# EAGLE design Simonette (EAGLE 5.11)
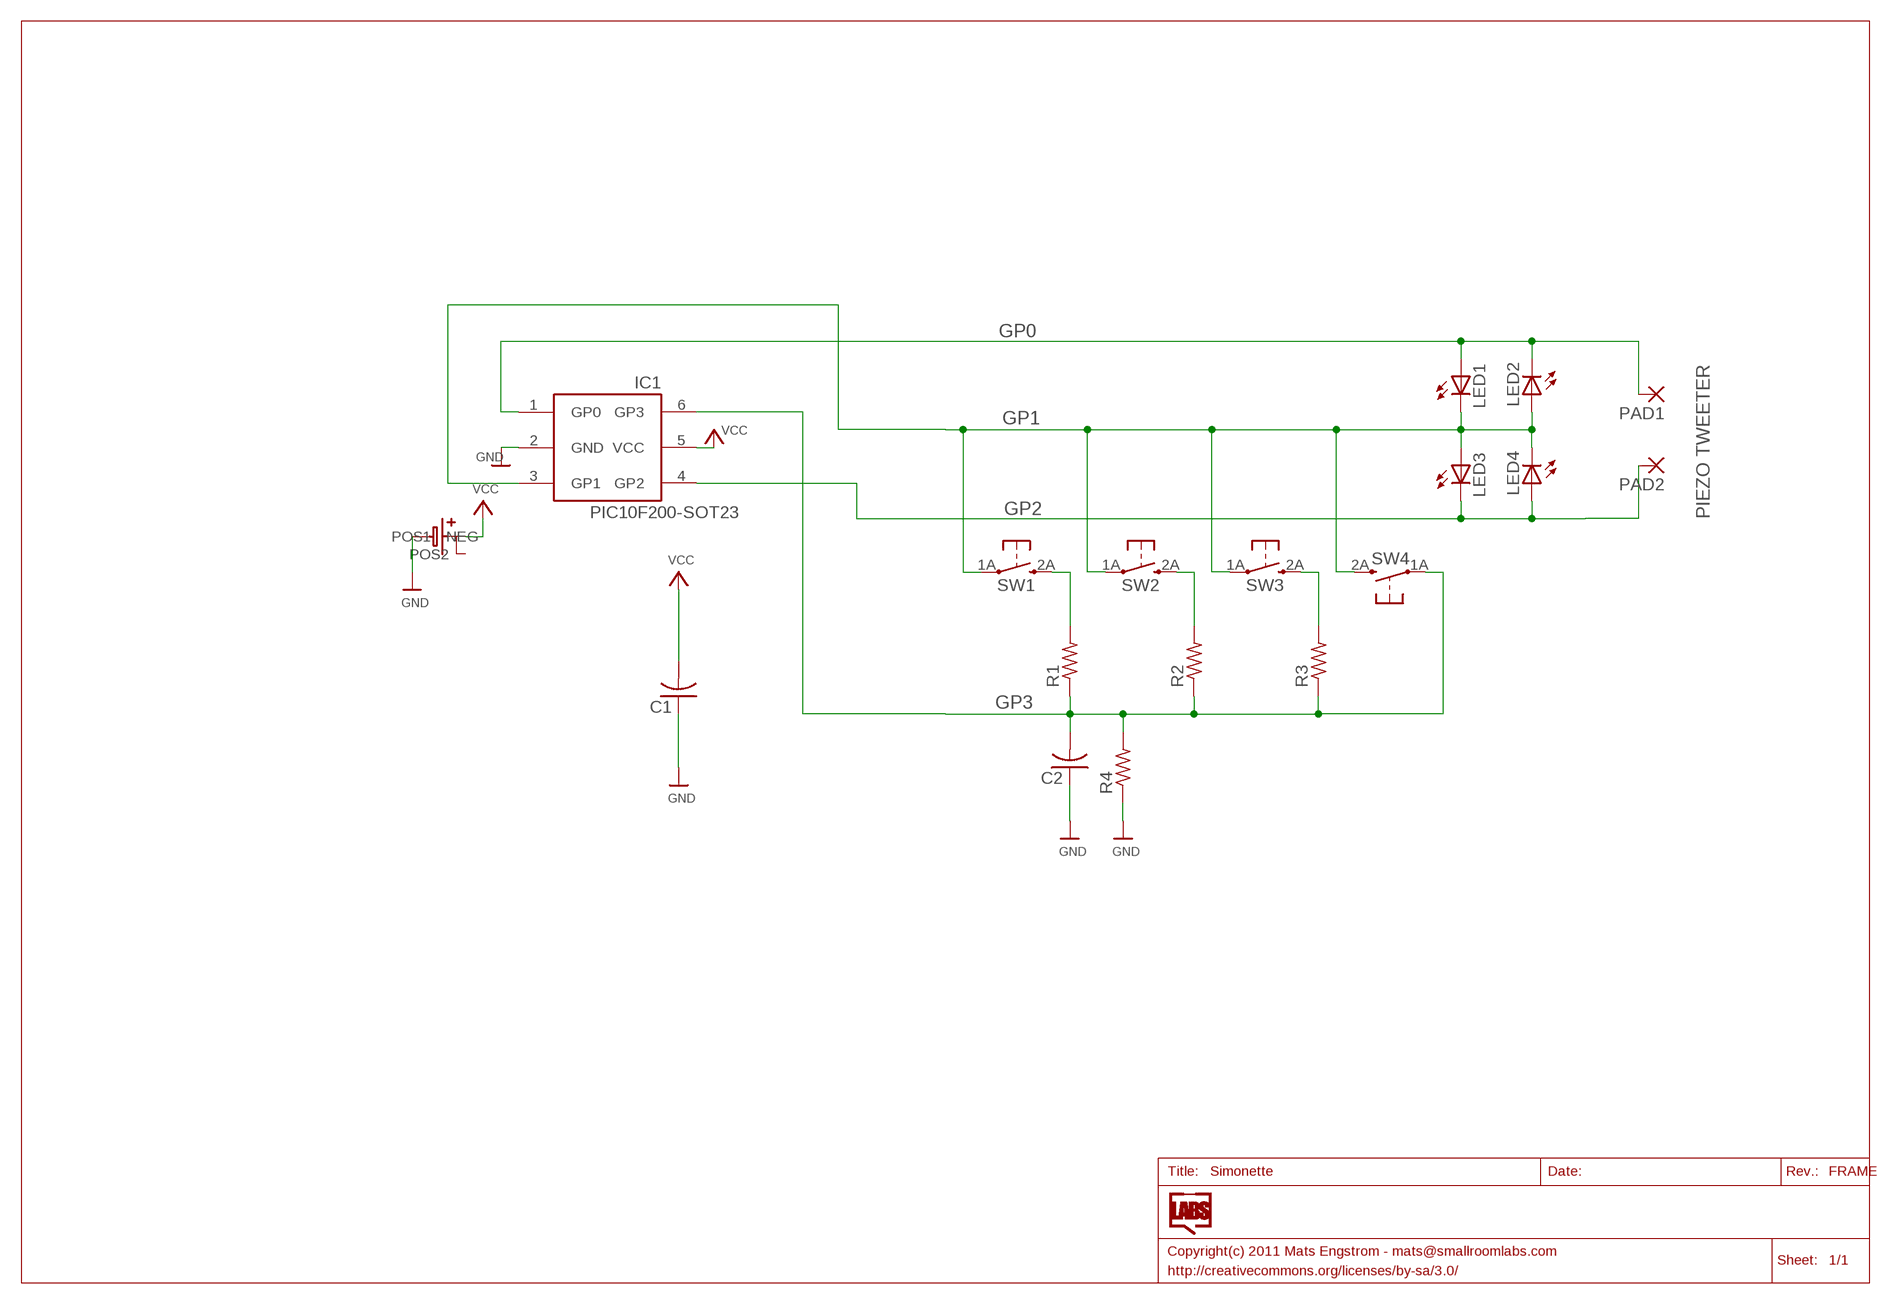
[diagram p0: schematic, sheet 1]

## Parts
C1  C-USC0805  [C0805]
C2  C-USC0805  [C0805]
IC1  PIC10F200-SOT23  [SOT23-6]
LED1  LEDCHIP-LED0805  [CHIP-LED0805]
LED2  LEDCHIP-LED0805  [CHIP-LED0805]
LED3  LEDCHIP-LED0805  [CHIP-LED0805]
LED4  LEDCHIP-LED0805  [CHIP-LED0805]
PAD1  SMD2  [SMD1,27-2,54]
PAD2  SMD2  [SMD1,27-2,54]
R1  R-US_R0805W  [R0805W]
R2  R-US_R0805W  [R0805W]
R3  R-US_R0805W  [R0805W]
R4  R-US_R0805W  [R0805W]
SW1  TACTILE1  [TACTILE-PTH-4.5-HALF]
SW2  TACTILE1  [TACTILE-PTH-4.5-HALF]
SW3  TACTILE1  [TACTILE-PTH-4.5-HALF]
SW4  TACTILE1  [TACTILE-PTH-4.5-HALF]
U$6  BATTERYCOIN-12MM-SMD  [CR1220-SMD]

## Nets
GND: C1.1 C2.1 IC1.2(GND) R4.1 U$6.-(NEG)
GP0: IC1.1(GP0) LED1.A LED2.C PAD1.1(P)
GP1: IC1.3(GP1) LED1.C LED2.A LED3.A LED4.C SW1.1A SW2.1A SW3.1A SW4.2A
GP2: IC1.4(GP2) LED3.C LED4.A PAD2.1(P)
GP3: C2.2 IC1.6(GP3) R1.1 R2.1 R3.1 R4.2 SW4.1A
N$1: R1.2 SW1.2A
N$3: R2.2 SW2.2A
N$4: R3.2 SW3.2A
VCC: C1.2 IC1.5(VCC) U$6.+$1(POS1)

## Notes on the sheet
- PIEZO TWEETER

## Power pins joined to a net without a drawn wire
POS2: U$6.+$2(POS2)

## Library data of the parts
C1 C2 = adafruit:C-US: CAPACITOR, American symbol
IC1 = SmallRoomLabs:PIC10F200
LED1-LED4 = adafruit:LED: LED OSRAM: - CHIPLED LG R971, LG N971, LY N971, LG Q971, LY Q971, LO R971, LY R971 LH N974, LH R974 LS Q976, LO Q976, LY Q976 LO Q996 - Hyper CHIPLED LW Q18S LB Q993, LB Q99A, LB R99A - SideLED LS A670, LO A670, LY A670, LG A670, LP A670 LB A673, LV A673, LT A673, LW A673 LH A674 LY A675 LS A676, LA A676, LO A676, LY A676, LW A676 LS A679, LY A679, LG A679 - Hyper Micro SIDELED® LS Y876, LA Y876, LO Y876, LY Y876 LT Y87S - SmartLED LW L88C, LW L88S LB L89C, LB L89S, LG L890 LS L89K, LO L89K, LY L89K LS L896, LA L896, LO L896, LY L896 - TOPLED LS T670, LO T670, LY T670, LG T670, LP T670 LSG T670, LSP T670, LSY T670, LOP T670, LYG T670 LG T671, LOG T671, LSG T671 LB T673, LV T673, LT T673, LW T673 LH T674 LS T676, LA T676, LO T676, LY T676, LB T676, LH T676, LSB T676, LW T676 LB T67C, LV T67C, LT T67C, LS T67K, LO T67K, LY T67K, LW E67C LS E67B, LA E67B, LO E67B, LY E67B, LB E67C, LV E67C, LT E67C LW T67C LS T679, LY T679, LG T679 LS T770, LO T770, LY T770, LG T770, LP T770 LB T773, LV T773, LT T773, LW T773 LH T774 LS E675, LA E675, LY E675, LS T675 LS T776, LA T776, LO T776, LY T776, LB T776 LHGB T686 LT T68C, LB T68C - Hyper Mini TOPLED® LB M676 - Mini TOPLED Santana® LG M470 LS M47K, LO M47K, LY M47K Source: http://www.osram.convergy.de/
PAD1 PAD2 = wirepad:SMD2: SMD PAD
R1-R4 = adafruit:R-US_: RESISTOR, American symbol
SW1-SW4 = SmallRoomLabs:TACTILE1
U$6 = SmallRoomLabs:BATTERY

## Net classes
0 default: width 0.305 mm, clearance 0.305 mm

## Board
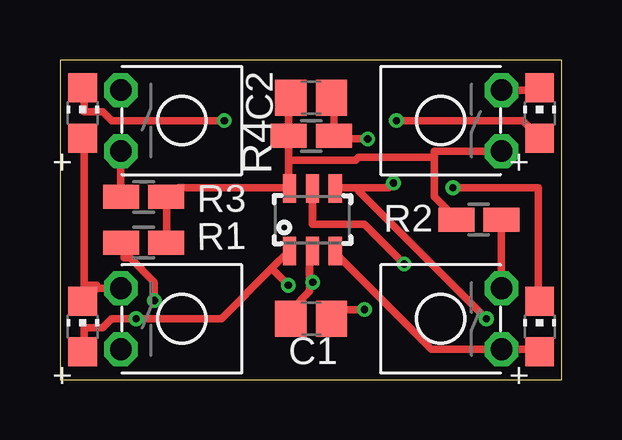
[diagram p1: board, top side]
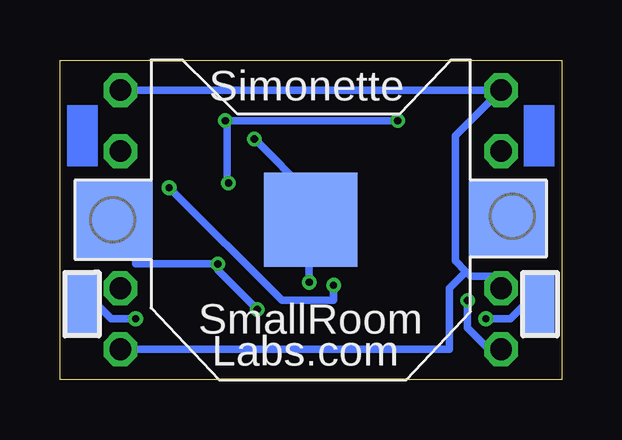
[diagram p2: board, bottom side, seen from below]

Size 20.93 x 13.32 mm. Coordinates in mm from the lower left corner, seen from the top.
Outline: 0,0 20.93,0 20.93,13.32 0,13.32 0,0
Copper layers (1*16): Top 0.035mm / dielectric 1.5mm / Bottom 0.035mm
Design rules "Fusion_eagle_rule_v1.1": minimum track width 6mil, minimum drill 12mil, track to track 6mil, track to pad 6mil, pad to pad 6mil, via to via 6mil, smd to smd 0mil, copper to edge 10mil, drill to drill 10mil, minimum pad ring 10mil, minimum via ring 6mil, stop-mask expansion 2mil, vias tented up to drill 100mil, thermal gap 10mil

### Footprints (pad centres in the part's own frame; a part is rotated, then mirrored left to right if it is on the bottom)
C0805 = smd 1.3 x 1.5: 1 -0.85,0; 2 0.85,0
SOT23-6 = smd 0.55 x 1.2: 1 0.32,-1.3; 2 1.27,-1.3; 3 2.22,-1.3; 4 2.22,1.3; 5 1.27,1.3; 6 0.32,1.3
CHIP-LED0805 = smd 1.2 x 1.2: A 0,-1.05; C 0,1.05
SMD1,27-2,54 = smd 1.27 x 2.54: 1 0,0
R0805W = smd 1.5 x 1: 1 -0.94,0; 2 0.94,0
TACTILE-PTH-4.5-HALF = drill 0.9 octagon: 1A -2.54,1.27; 2A -2.54,-1.27
CR1220-SMD = smd 3.2 x 3.2: +$1 -8.2,0; +$2 8.2,0 | smd 3.9 x 3.9: - 0,0

### Placement (x,y rotation side)
C1  10.48,2.54 0 top
C2  10.48,11.75 180 top
IC1  9.26,6.67 0 top
LED1  0.95,2.22 0 top
LED2  20,2.22 0 top
LED3  0.95,11.11 0 top
LED4  20,11.11 0 top
PAD1  0.95,3.17 0 bottom
PAD2  20,3.17 0 bottom
R1  3.49,5.71 180 top
R2  17.46,6.67 0 top
R3  3.49,7.62 180 top
R4  10.48,10.16 180 top
SW1  5.08,2.54 0 top
SW2  15.88,2.54 180 top
SW3  5.08,10.79 0 top
SW4  15.88,10.79 180 top
U$6  10.48,6.67 0 bottom

### Tracks (layer width: path | path; a pad name or v marks a point on that pad's centre or on a via)
GND  (via drill 0.3)
  Top 0.305: 10.41,4.06 10.41,3.68 9.65,2.92 9.65,2.54 C1.1 | 10.41,4.06 10.41,5.33 IC1.2 | C2.1 11.43,11.68 R4.1 11.56,10.16 11.68,10.03 v12.83,10.03 | 10.41,4.06 v10.54,4.06
  Bottom 0.305: v12.83,10.03 10.54,7.75 10.54,6.73 U$6.- 10.54,6.6 v10.54,4.06
GP0  (via drill 0.3)
  Top 0.305: 8.83,4.64 9.53,5.33 IC1.1 | 8.83,4.64 6.73,2.54 v3.17,2.54 2.16,2.54 1.78,2.16 1.02,2.16 1.02,1.27 LED1.A | v16.38,8 19.94,8 19.94,3.3 LED2.C | 8.83,4.64 v9.53,3.94
  Bottom 0.305: v16.38,8 11.68,3.3 9.53,3.3 v9.53,3.94 | v3.17,2.54 2.16,2.54 1.52,3.17 PAD1.1
GP1
  Top 0.305: IC1.3 11.43,5.33 15.49,1.27 SW2.1A 19.94,1.27 LED2.A | SW4.2A 19.94,12.06 LED4.C | 1.52,3.81 1.02,3.3 LED1.C | 1.52,3.81 SW1.1A | LED3.A 1.02,10.03 1.02,3.94 1.52,3.94 1.52,3.81
  Bottom 0.305: 4,4.51 3.81,4.32 2.54,4.32 SW1.1A | 4,4.51 4.45,4.95 4.45,10.16 SW3.1A SW4.2A | SW2.1A 4.7,1.27 4.7,3.81 4,4.51
GP2  (via drill 0.3)
  Top 0.305: v6.86,10.79 2.16,10.79 1.78,11.18 1.02,11.18 1.02,12.06 LED3.C | 11.43,8 IC1.4 11.56,8 12.45,8 | v14.03,10.79 19.3,10.79 19.94,10.16 LED4.A | 12.45,8 13.72,8 v13.91,8.19 | v17.78,2.54 12.45,7.87 12.45,8
  Bottom 0.305: v17.78,2.54 18.8,2.54 19.43,3.17 PAD2.1 | v13.91,8.19 13.97,8.26 13.97,10.79 v14.03,10.79 v6.86,10.79
GP3
  Top 0.305: 15.62,9.27 15.62,9.53 SW4.1A | 15.62,9.27 15.62,7.62 16.51,6.73 R2.1 | R1.1 4.45,5.71 4.45,7.62 R3.1 4.57,7.62 4.95,8 9.4,8 IC1.6 9.53,8 9.53,9.14 | 9.53,9.14 9.53,10.16 R4.2 9.53,10.29 9.53,11.68 C2.2 | 15.62,9.27 12.45,9.27 12.32,9.14 9.53,9.14
N$1  (via drill 0.3)
  Top 0.305: v3.94,3.3 3.94,4.06 2.92,5.08 2.67,5.08 2.67,5.71 R1.2
  Bottom 0.305: v3.94,3.3 3.94,2.16 3.05,1.27 SW1.2A
N$3
  Top 0.305: SW2.2A 18.41,6.6 R2.2
N$4
  Top 0.305: SW3.2A R3.2
VCC  (via drill 0.3)
  Top 0.305: v14.35,4.83 12.7,6.48 10.54,6.48 10.54,7.87 IC1.5 | v12.7,2.92 11.81,2.92 11.43,2.54 C1.2
  Bottom 0.305: U$6.+$1 18.67,6.6 17.78,5.71 17.78,4.83 v14.35,4.83 14.35,4.57 v12.7,2.92
(copper drawn outside any net)
  shapes: Bottom area x2

### Text on the board
tPlace: C2 | R3 | R2 | R1 | C1
bPlace: Simonette | SmallRoom | Labs.com